# Altium schematic sheet [01] - COVER PAGE.SchDoc: DOCUMENT TITLE
size A4; Organization: Bjørn T. Brodtkorb; Address1: Frode Rinnans veg 161; Address2: 7050 Trondheim; DocumentNumber: 6598; Revision: 1.0; SheetNumber: 1; SheetTotal: 1
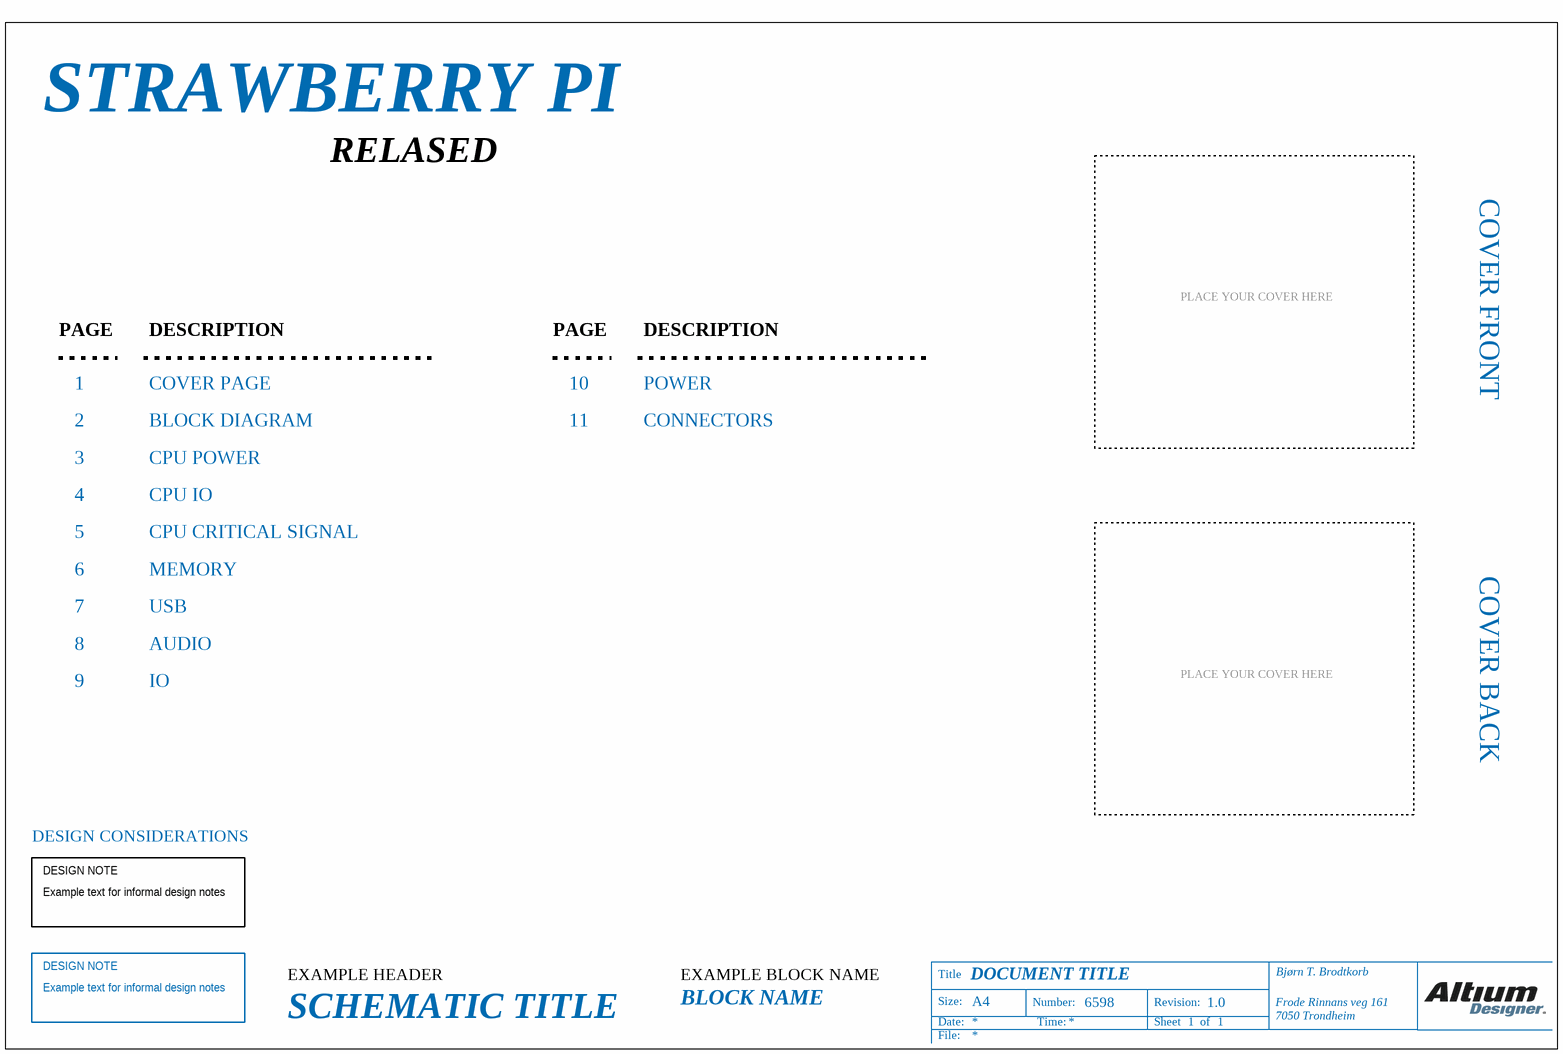
[diagram p0: [01] - COVER PAGE.SchDoc]

## Notes on the sheet
- STRAWBERRY PI
- RELASED
- COVER FRONT
- PLACE YOUR COVER HERE
- PAGE
- 1
- DESCRIPTION
- COVER PAGE
- 10
- POWER
- 2
- 3
- BLOCK DIAGRAM
- CPU POWER
- 11
- CONNECTORS
- 4
- CPU IO
- 5
- 6
- CPU CRITICAL SIGNAL
- MEMORY
- COVER BACK
- 7
- 8
- USB
- AUDIO
- 9
- IO
- DESIGN CONSIDERATIONS
- DESIGN NOTE
- Example text for informal design notes
- EXAMPLE HEADER
- BLOCK NAME
- EXAMPLE BLOCK NAME
- SCHEMATIC TITLE
- Title
- Size:
- A4
- Number:
- Revision:
- Date:
- File:
- Time:
- Sheet
- of